# Altium schematic sheet Power Distribution Block Diagram.SchDoc: Power Distribution Block Diagram
size D; DrawnBy: C. Lewis; Engineer: C. Lewis; Address1: 4650 NORRIS CANYON RD.; Address2: SAN RAMON, CA 94583; DocumentNumber: 35133; Revision: D; SheetNumber: 17; SheetTotal: 20; PageSetup: Record=PageOptions|CenterHorizontal=True|CenterVertical=True|PrintScale=0.51|XCorrection=1.00|YCorrection=1.00|PrintKind=1|BorderSize=5000000|LeftOffset=0|BottomOffset=0|Orientation=2|PaperLength=1000|PaperWidth=1000|Scale=100|PaperSource=15|PrintQuality=600|MediaType=1|DitherType=10|PaperKind=11x17|PrintScaleMode=1
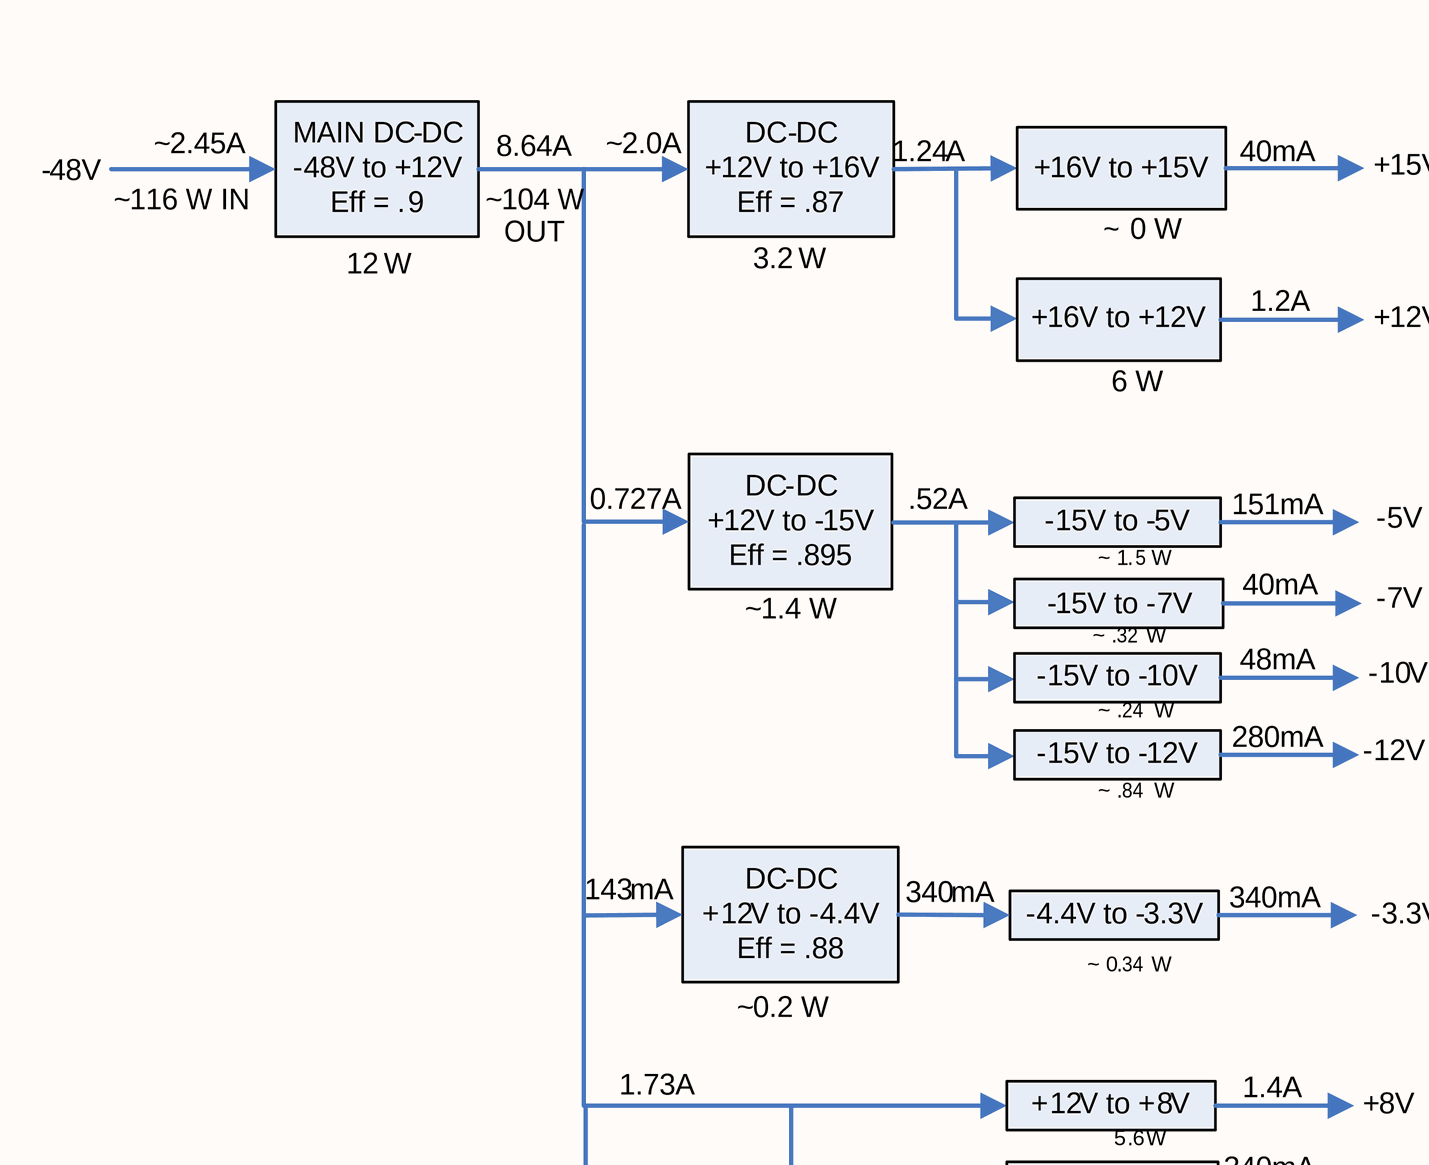
[diagram p0: Power Distribution Block Diagram.SchDoc, top left]
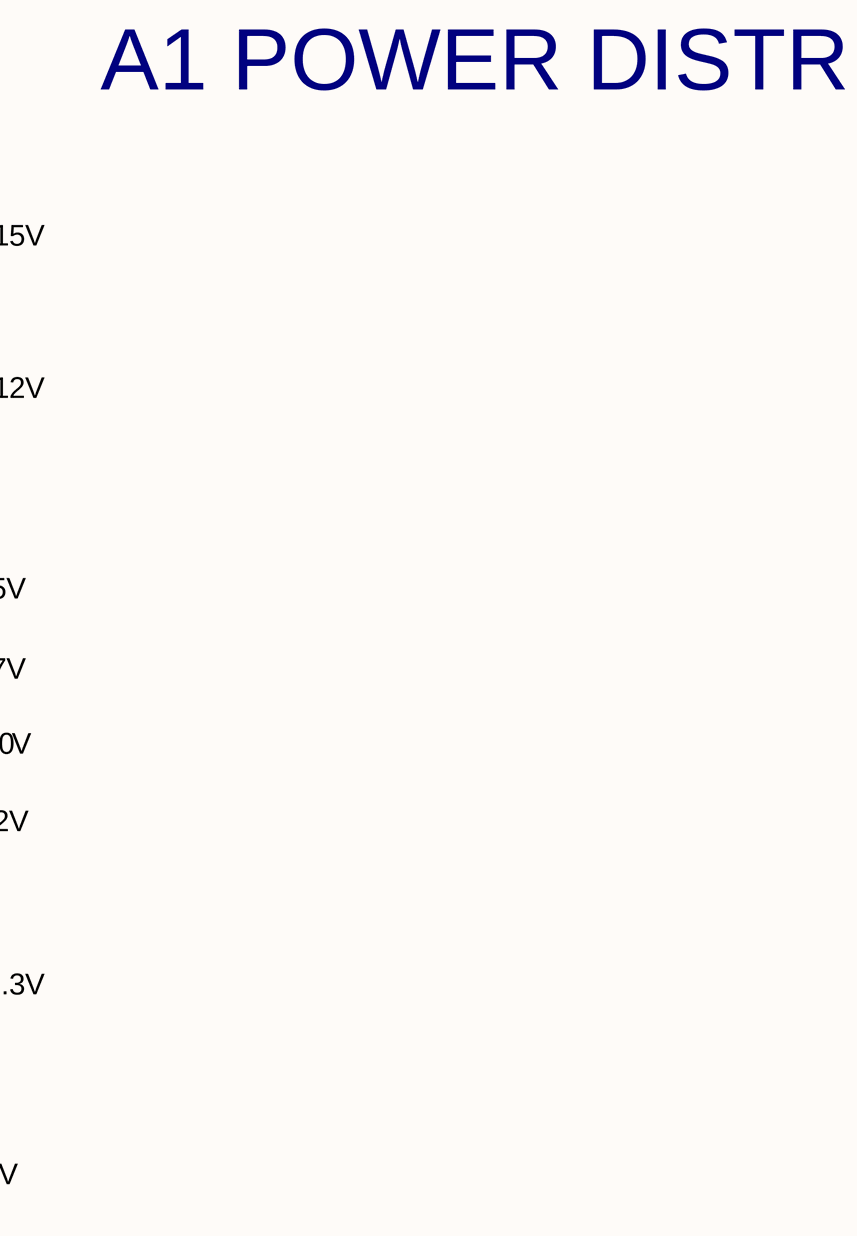
[diagram p1: Power Distribution Block Diagram.SchDoc, top middle]
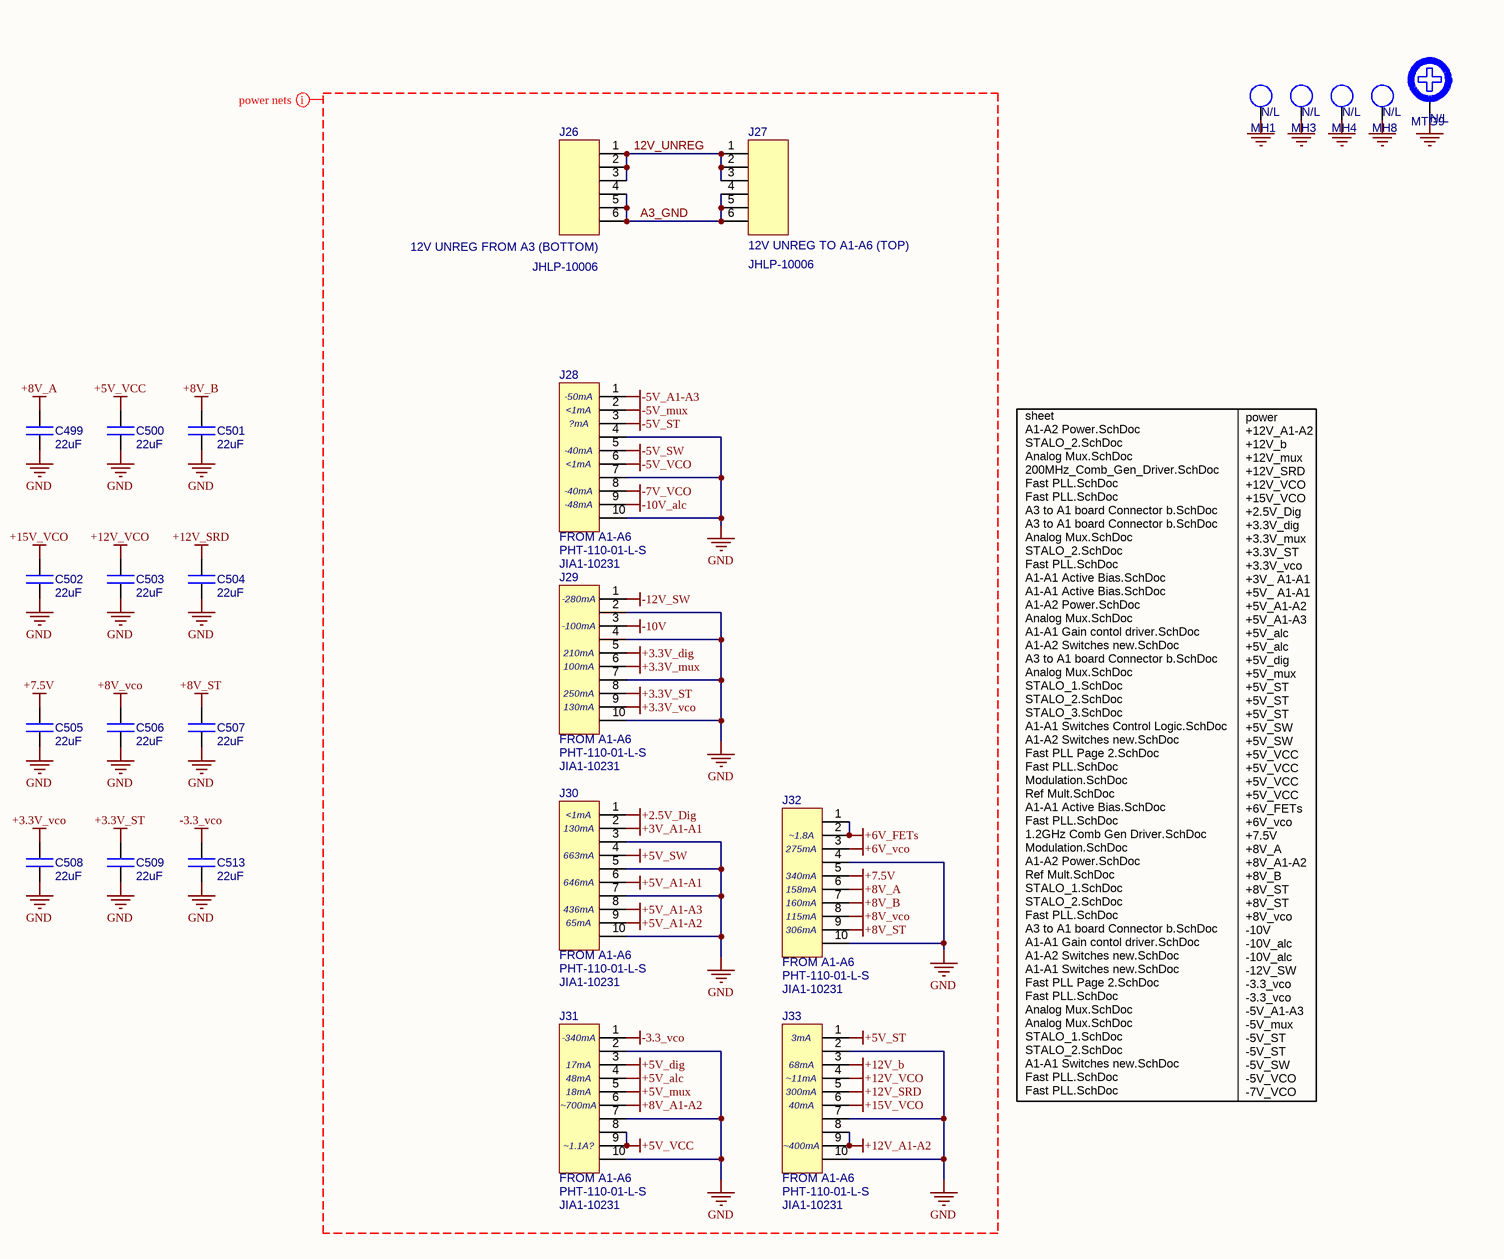
[diagram p2: Power Distribution Block Diagram.SchDoc, top right]
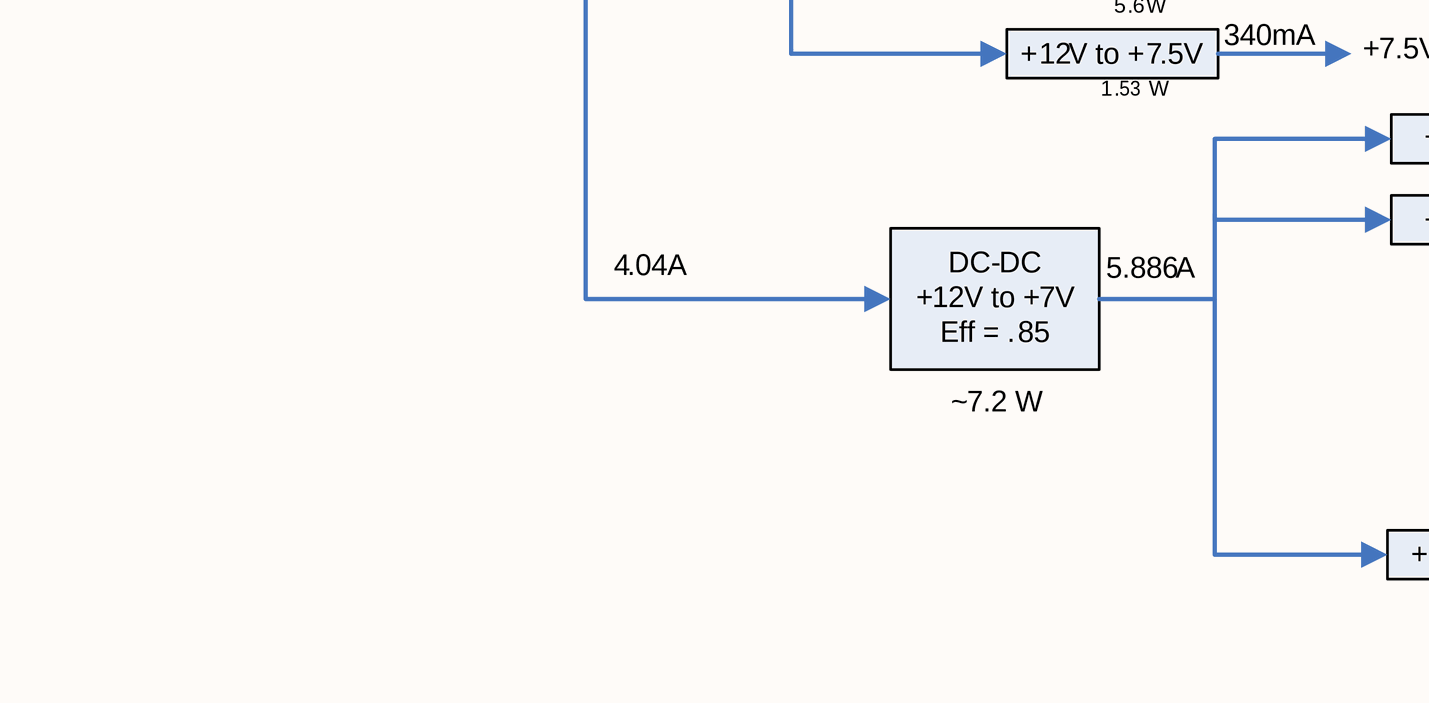
[diagram p3: Power Distribution Block Diagram.SchDoc, bottom left]
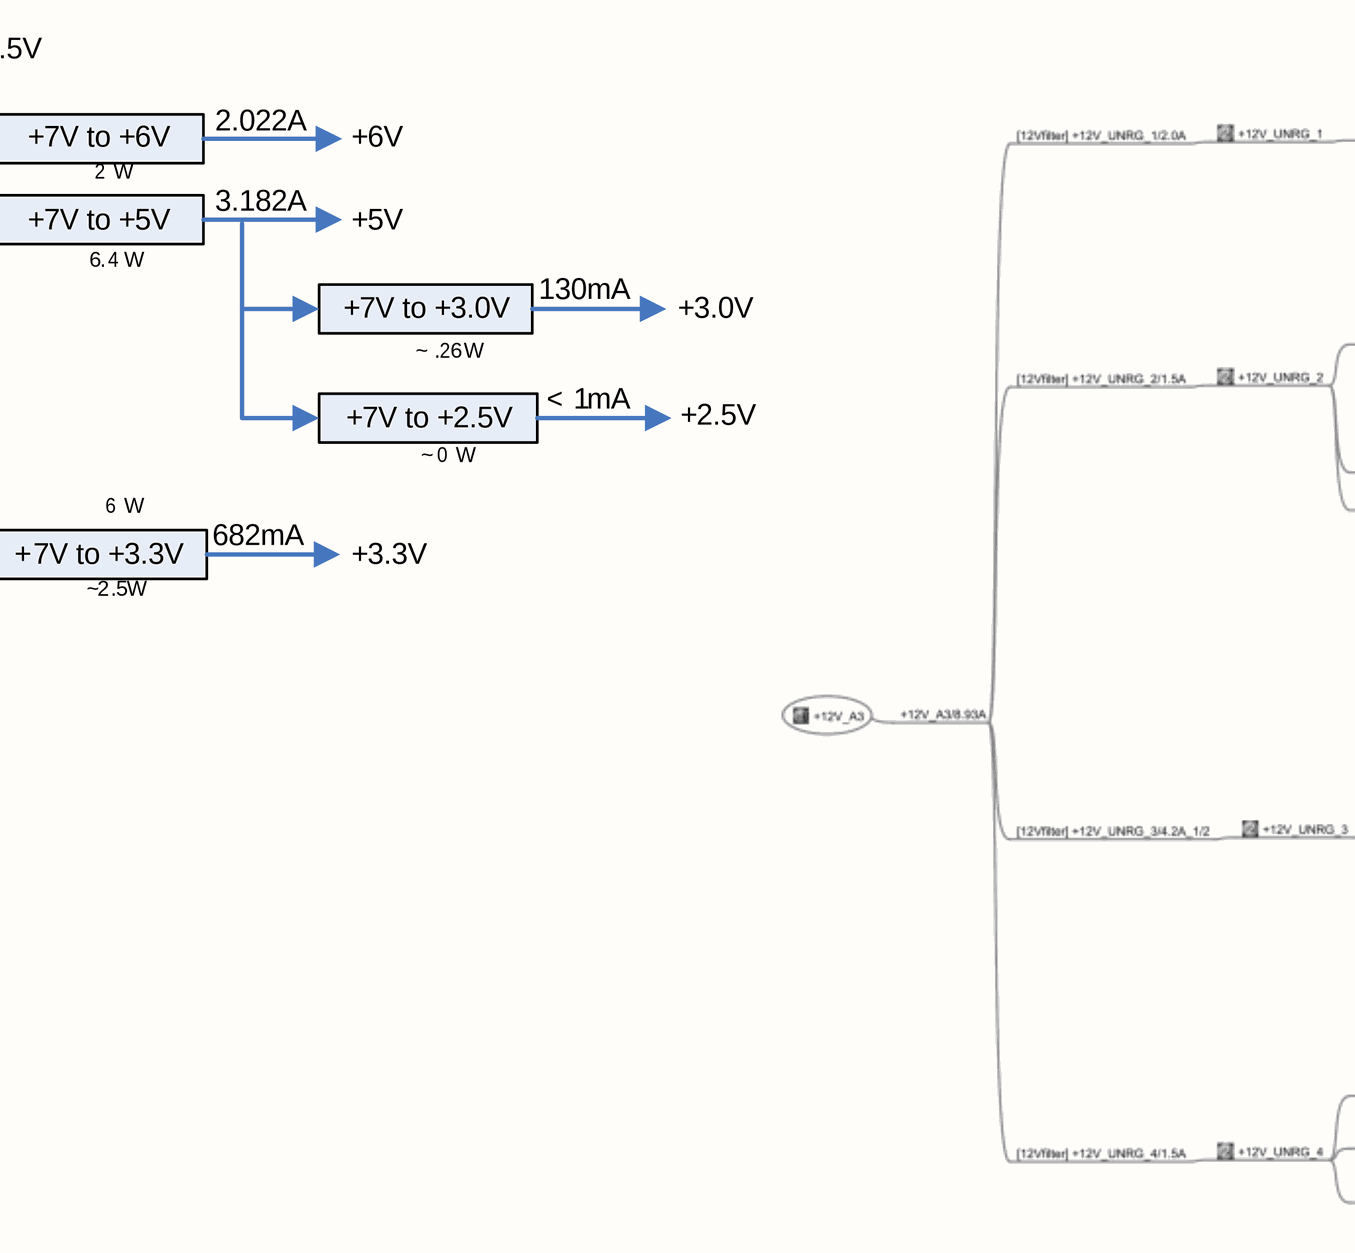
[diagram p4: Power Distribution Block Diagram.SchDoc, bottom middle]
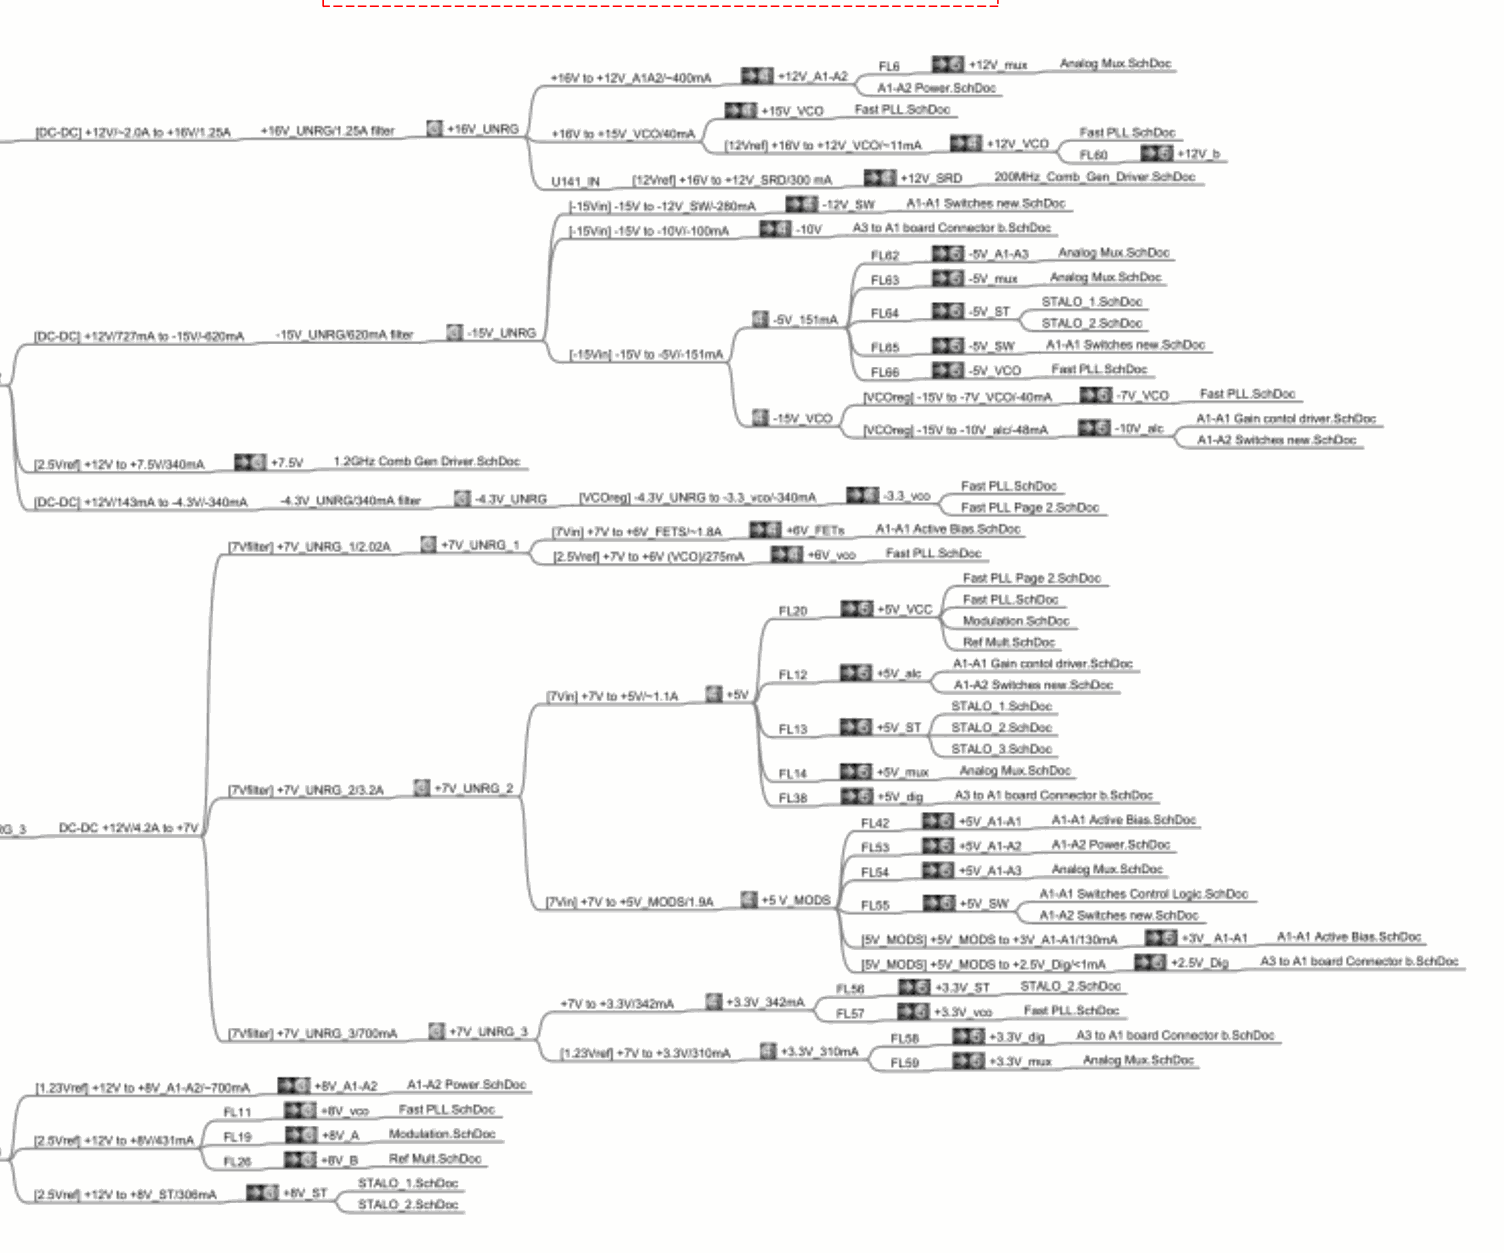
[diagram p5: Power Distribution Block Diagram.SchDoc, bottom right]

## Parts
C499  value 22uF  [CAP-1210-N]  (hidden comment: 22uF;X5R;CERAMIC CHIP;25V;1210)
C500  value 22uF  [CAP-1210-N]  (hidden comment: 22uF;X5R;CERAMIC CHIP;25V;1210)
C501  value 22uF  [CAP-1210-N]  (hidden comment: 22uF;X5R;CERAMIC CHIP;25V;1210)
C502  value 22uF  [CAP-1210-N]  (hidden comment: 22uF;X5R;CERAMIC CHIP;25V;1210)
C503  value 22uF  [CAP-1210-N]  (hidden comment: 22uF;X5R;CERAMIC CHIP;25V;1210)
C504  value 22uF  [CAP-1210-N]  (hidden comment: 22uF;X5R;CERAMIC CHIP;25V;1210)
C505  value 22uF  [CAP-1210-N]  (hidden comment: 22uF;X5R;CERAMIC CHIP;25V;1210)
C506  value 22uF  [CAP-1210-N]  (hidden comment: 22uF;X5R;CERAMIC CHIP;25V;1210)
C507  value 22uF  [CAP-1210-N]  (hidden comment: 22uF;X5R;CERAMIC CHIP;25V;1210)
C508  value 22uF  [CAP-1210-N]  (hidden comment: 22uF;X5R;CERAMIC CHIP;25V;1210)
C509  value 22uF  [CAP-1210-N]  (hidden comment: 22uF;X5R;CERAMIC CHIP;25V;1210)
C513  value 22uF  [CAP-1210-N]  (hidden comment: 22uF;X5R;CERAMIC CHIP;25V;1210)
J26  12V UNREG FROM A3 (BOTTOM)  [JHLP-10006]
J27  12V UNREG TO A1-A6 (TOP)  [JHLP-10006]
J28  FROM A1-A6  M_PN: PHT-110-01-L-S  [JIA1-10231]
J29  FROM A1-A6  M_PN: PHT-110-01-L-S  [JIA1-10231]
J30  FROM A1-A6  M_PN: PHT-110-01-L-S  [JIA1-10231]
J31  FROM A1-A6  M_PN: PHT-110-01-L-S  [JIA1-10231]
J32  FROM A1-A6  M_PN: PHT-110-01-L-S  [JIA1-10231]
J33  FROM A1-A6  M_PN: PHT-110-01-L-S  [JIA1-10231]
MH1  N/L  [MHP-250X116]
MH3  N/L  [MHP-250X116]
MH4  N/L  [MHP-250X116]
MH8  N/L  [MHP-250X116]
MTG9  NoLoad: N/L  [MHP-250X116]

## Nets
+2.5V_Dig: J30.1
+3.3V_dig: J29.5
+3.3V_mux: J29.6
+3.3V_ST: C509.2 J29.8
+3.3V_vco: C508.2 J29.9
+3V_A1-A1: J30.2
+5V_A1-A1: J30.6
+5V_A1-A2: J30.9
+5V_A1-A3: J30.8
+5V_alc: J31.4
+5V_dig: J31.3
+5V_mux: J31.5
+5V_ST: J33.1
+5V_SW: J30.4
+5V_VCC: C500.2 J31.8 J31.9
+6V_FETs: J32.1 J32.2
+6V_vco: J32.3
+7.5V: C505.2 J32.5
+8V_A: C499.2 J32.6
+8V_A1-A2: J31.6
+8V_B: C501.2 J32.7
+8V_ST: C507.2 J32.9
+8V_vco: C506.2 J32.8
+12V_A1-A2: J33.8 J33.9
+12V_b: J33.3
+12V_SRD: C504.2 J33.5
+12V_VCO: C503.2 J33.4
+15V_VCO: C502.2 J33.6
-3.3_vco: C513.2 J31.1
-5V_A1-A3: J28.1
-5V_mux: J28.2
-5V_ST: J28.3
-5V_SW: J28.5
-5V_VCO: J28.6
-7V_VCO: J28.8
-10V: J29.3
-10V_alc: J28.9
-12V_SW: J29.1
GND: C499.1 C500.1 C501.1 C502.1 C503.1 C504.1 C505.1 C506.1 C507.1 C508.1 C509.1 C513.1 J28.4 J28.7 J28.10 J29.2 J29.4 J29.7 J29.10 J30.3 J30.5 J30.7 J30.10 J31.2 J31.7 J31.10 J32.4 J32.10 J33.2 J33.7 J33.10 MH1.MH MH3.MH MH4.MH MH8.MH MTG9.MH
12V_UNREG: J26.1 J26.2 J26.3 J27.1 J27.2 J27.3
A3_GND: J26.4 J26.5 J26.6 J27.4 J27.5 J27.6

## Layout directives
net class power nets: 12V_UNREG, +2.5V_Dig, +3.3V_dig, +3.3V_mux, +3.3V_ST, +3.3V_vco, +3V_A1-A1, +5V_A1-A1, +5V_A1-A2, +5V_A1-A3, +5V_alc, +5V_dig, +5V_mux, +5V_ST, +5V_SW, +5V_VCC, +6V_FETs, +6V_vco, +7.5V, +8V_A, +8V_A1-A2, +8V_B, +8V_ST, +8V_vco, +12V_A1-A2, +12V_b, +12V_SRD, +12V_VCO, +15V_VCO, -3.3_vco, -5V_A1-A3, -5V_mux, -5V_ST, -5V_SW, -5V_VCO, -7V_VCO, -10V, -10V_alc, -12V_SW, A3_GND, GND

## Notes on the sheet
- A1 POWER DISTRIBUTION
- (near J28) -50mA
- (near J28) <1mA
- (near J28) -40mA
- (near J28) ?mA
- (near J28) -48mA
- (near J29) -280mA
- (near J29) -100mA
- (near J29) 210mA
- (near J29) 100mA
- (near J29) 250mA
- (near J29) 130mA
- (near J30) <1mA
- (near J30) 130mA
- (near J30) 646mA
- (near J30) 663mA
- (near J32) ~1.8A
- (near J32) 275mA
- (near J32) 340mA
- (near J32) 158mA
- (near J30) 65mA
- (near J30) 436mA
- (near J32) 160mA
- (near J32) 306mA
- (near J32) 115mA
- (near J31) -340mA
- (near J31) 17mA
- (near J31) 48mA
- (near J33) 3mA
- (near J33) 68mA
- (near J33) ~11mA
- (near J31) ~1.1A?
- (near J31) 18mA
- (near J31) ~700mA
- (near J33) ~400mA
- (near J33) 300mA
- (near J33) 40mA
- sheet
  A1-A2 Power.SchDoc
  STALO_2.SchDoc
  Analog Mux.SchDoc
  200MHz_Comb_Gen_Driver.SchDoc
  Fast PLL.SchDoc
  Fast PLL.SchDoc
  A3 to A1 board Connector b.SchDoc
  A3 to A1 board Connector b.SchDoc
  Analog Mux.SchDoc
  STALO_2.SchDoc
  Fast PLL.SchDoc
  A1-A1 Active Bias.SchDoc
  A1-A1 Active Bias.SchDoc
  A1-A2 Power.SchDoc
  Analog Mux.SchDoc
  A1-A1 Gain contol driver.SchDoc
  A1-A2 Switches new.SchDoc
  A3 to A1 board Connector b.SchDoc
  Analog Mux.SchDoc
  STALO_1.SchDoc
  STALO_2.SchDoc
  STALO_3.SchDoc
  A1-A1 Switches Control Logic.SchDoc
  A1-A2 Switches new.SchDoc
  Fast PLL Page 2.SchDoc
  Fast PLL.SchDoc
  Modulation.SchDoc
  Ref Mult.SchDoc
  A1-A1 Active Bias.SchDoc
  Fast PLL.SchDoc
  1.2GHz Comb Gen Driver.SchDoc
  Modulation.SchDoc
  A1-A2 Power.SchDoc
  Ref Mult.SchDoc
  STALO_1.SchDoc
  STALO_2.SchDoc
  Fast PLL.SchDoc
  A3 to A1 board Connector b.SchDoc
  A1-A1 Gain contol driver.SchDoc
  A1-A2 Switches new.SchDoc
  A1-A1 Switches new.SchDoc
  Fast PLL Page 2.SchDoc
  Fast PLL.SchDoc
  Analog Mux.SchDoc
  Analog Mux.SchDoc
  STALO_1.SchDoc
  STALO_2.SchDoc
  A1-A1 Switches new.SchDoc
  Fast PLL.SchDoc
  Fast PLL.SchDoc
- power
  +12V_A1-A2
  +12V_b
  +12V_mux
  +12V_SRD
  +12V_VCO
  +15V_VCO
  +2.5V_Dig
  +3.3V_dig
  +3.3V_mux
  +3.3V_ST
  +3.3V_vco
  +3V_ A1-A1
  +5V_ A1-A1
  +5V_A1-A2
  +5V_A1-A3
  +5V_alc
  +5V_alc
  +5V_dig
  +5V_mux
  +5V_ST
  +5V_ST
  +5V_ST
  +5V_SW
  +5V_SW
  +5V_VCC
  +5V_VCC
  +5V_VCC
  +5V_VCC
  +6V_FETs
  +6V_vco
  +7.5V
  +8V_A
  +8V_A1-A2
  +8V_B
  +8V_ST
  +8V_ST
  +8V_vco
  -10V
  -10V_alc
  -10V_alc
  -12V_SW
  -3.3_vco
  -3.3_vco
  -5V_A1-A3
  -5V_mux
  -5V_ST
  -5V_ST
  -5V_SW
  -5V_VCO
  -7V_VCO
- Title
- Sheet Title
- PRINTED DOCUMENT IS CONSIDERED UNCONTROLLED. VERIFY REVISION IN PLM SYSTEM.
- THIS DOCUMENT CONTAINS PROPRIETARY INFORMATION. DESIGN RIGHTS BELONG TO GIGA-TRONICS AND MAY NOT BE REPRODUCED WITHOUT WRITTEN AUTHORIZATION FOR ANY REASON EXCEPT CALIBRATION, OPERATION AND MAINTENANCE.
- Size
- CAGE CODE
- Filename
- D
- Document Number
- 58900
- Date
- Sheet
- Rev
- of

## Library data of the parts
C499-C509 C513 = CK60-26220: Approved: CL; NoLoad: .; MFGR: ANY; level: 1; line_number: 212; G_PN: CK60-26220; ModifyDate: 3/23/13; M_PN: ANY; item_number: CK60-26220
J26 J27 = JHLP-10006: LOCKING HEADER;.1CNTR;6PIN STR; Approved: FV; NoLoad: .; MFGR: AMP; M_PN: 641126-6; level: 1; line_number: 487; ModifyDate: 07/23/2013; G_PN: JHLP-10006; item_number: JHLP-10006
J28-J33 = JIA1-10231: STRIPLINE PLUG;.1 CTR;10 PIN;SINGLE ROW;.230;PRESS FIT;GOLD; NoLoad: .; MFGR: SAMTEC; level: 1; line_number: 490; ModifyDate: 08/14/2013; G_PN: JIA1-10231; item_number: JIA1-10231
MH1 MH3 MH4 MH8 = MHP-250X116: level: 1; NoLoad: N/L; ModifyDate: 02/14/2008 14:07:19; Value: *
MTG9 = MHP250X116: level: 1; ModifyDate: 8/8/13; Value: *